# EAGLE design meetring ic (EAGLE 9.6.2)
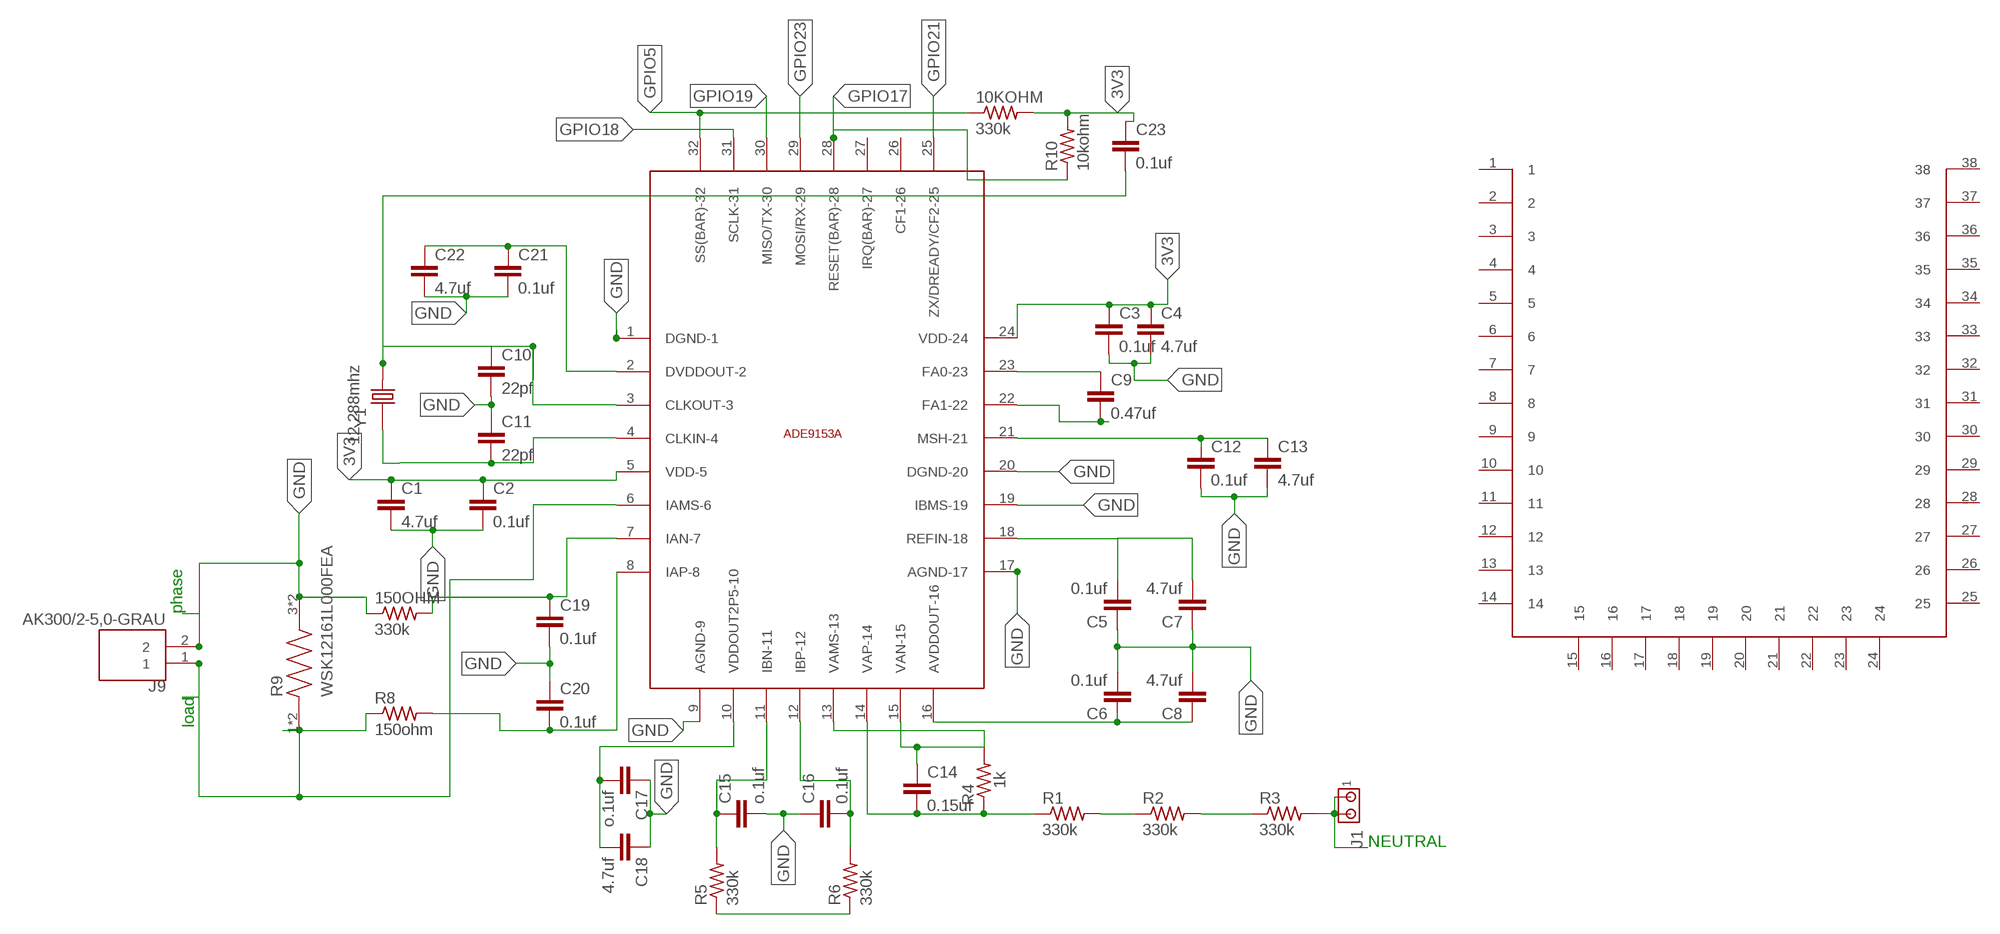
[diagram p0: schematic, sheet 1]

## Parts
10KOHM  330k  R-US_0204/7  [0204/7]
150OHM  330k  R-US_0204/7  [0204/7]
C1  4.7uf  C2.5/2  [C2.5-2]
C2  0.1uf  C2.5/2  [C2.5-2]
C3  0.1uf  C2.5/2  [C2.5-2]
C4  4.7uf  C2.5/2  [C2.5-2]
C5  0.1uf  C2.5/2  [C2.5-2]
C6  0.1uf  C2.5/2  [C2.5-2]
C7  4.7uf  C2.5/2  [C2.5-2]
C8  4.7uf  C2.5/2  [C2.5-2]
C9  0.47uf  C2.5/2  [C2.5-2]
C10  22pf  C2.5/2  [C2.5-2]
C11  22pf  C2.5/2  [C2.5-2]
C12  0.1uf  C2.5/2  [C2.5-2]
C13  4.7uf  C2.5/2  [C2.5-2]
C14  0.15uf  C2.5/2  [C2.5-2]
C15  o.1uf  C2.5/2  [C2.5-2]
C16  0.1uf  C2.5/2  [C2.5-2]
C17  o.1uf  C2.5/2  [C2.5-2]
C18  4.7uf  C2.5/2  [C2.5-2]
C19  0.1uf  C2.5/2  [C2.5-2]
C20  0.1uf  C2.5/2  [C2.5-2]
C21  0.1uf  C2.5/2  [C2.5-2]
C22  4.7uf  C2.5/2  [C2.5-2]
C23  0.1uf  C2.5/2  [C2.5-2]
J1  MTA02-156  [1X2MTA]
J9  AK300/2-5,0-GRAU  [PTR_AK300/2-5,0-GRAU]
R1  330k  R-US_0204/7  [0204/7]
R2  330k  R-US_0204/7  [0204/7]
R3  330k  R-US_0204/7  [0204/7]
R4  1k  R-US_0204/7  [0204/7]
R5  330k  R-US_0204/7  [0204/7]
R6  330k  R-US_0204/7  [0204/7]
R8  150ohm  R-US_0204/7  [0204/7]
R9  WSK12161L000FEA  [RES_WSK12161L000FEA]
R10  10kohm  R-US_0204/7  [0204/7]
U$1  ADE9153A_BASEADE9153A_BASE  [ADE9153A_BASE]
U$2  LIB1OPTION_HOLE  [1X14MTA]
Y1  12.288mhz  ECS-240.0001-18-1X  [XTAL_ECS-200-20-1X]

## Nets
3V3: 10KOHM.2 C1.1 C2.1 C3.1 C4.1 C23.1 R10.2 U$1.5(VDD-5) U$1.24(VDD-24)
GND: 150OHM.1 C1.2 C2.2 C3.2 C4.2 C5.1 C6.2 C7.1 C8.2 C10.2 C11.1 C12.2 C13.2 C15.2 C16.1 C17.1 C18.1 C19.2 C20.1 C21.2 C22.2 J9.2 R9.3 R9.4 U$1.1(DGND-1) U$1.9(AGND-9) U$1.17(AGND-17) U$1.19(IBMS-19) U$1.20(DGND-20)
GPIO5: 10KOHM.1 U$1.32(SS(BAR)-32)
GPIO17: R10.1 U$1.28(RESET(BAR)-28)
GPIO18: U$1.31(SCLK-31)
GPIO19: U$1.30(MISO/TX-30)
GPIO21: U$1.25(ZX/DREADY/CF2-25)
GPIO23: U$1.29(MOSI/RX-29)
N$3: C6.1 C8.1 U$1.16(AVDDOUT-16)
N$4: C5.2 C7.2 U$1.18(REFIN-18)
N$5: C9.1 U$1.23(FA0-23)
N$6: C9.2 U$1.22(FA1-22)
N$7: C11.2 U$1.4(CLKIN-4) Y1.1
N$8: C10.1 C23.2 U$1.3(CLKOUT-3) Y1.2
N$9: C12.1 C13.1 U$1.21(MSH-21)
N$11: C14.2 R1.1 R4.1 U$1.14(VAP-14)
N$12: R1.2 R2.1
N$13: R2.2 R3.1
N$14: C14.1 R4.2 U$1.13(VAMS-13) U$1.15(VAN-15)
N$15: C16.2 R6.2 U$1.12(IBP-12)
N$16: C15.1 R5.2 U$1.11(IBN-11)
N$18: C17.2 C18.2 U$1.10(VDDOUT2P5-10)
N$19: R5.1 R6.1
N$20: 150OHM.2 C19.1 U$1.7(IAN-7)
N$21: C20.2 R8.2 U$1.8(IAP-8)
N$22: C21.1 C22.1 U$1.2(DVDDOUT-2)
N$24: J9.1 R8.1 R9.1 R9.2 U$1.6(IAMS-6)
N$27: J1.1 J1.2 R3.2
Unconnected: U$1.26(CF1-26) U$1.27(IRQ(BAR)-27) U$2.1 U$2.2 U$2.3 U$2.4 U$2.5 U$2.6 U$2.7 U$2.8 U$2.9 U$2.10 U$2.11 U$2.12 U$2.13 U$2.14 U$2.15 U$2.16 U$2.17 U$2.18 U$2.19 U$2.20 U$2.21 U$2.22 U$2.23 U$2.24 U$2.25 U$2.26 U$2.27 U$2.28 U$2.29 U$2.30 U$2.31 U$2.32 U$2.33 U$2.34 U$2.35 U$2.36 U$2.37 U$2.38

## Notes on the sheet
- phase
- load
- NEUTRAL

## Library data of the parts
10KOHM 150OHM R1-R6 R8 R10 = rcl:R-US_: RESISTOR, American symbol; SPICEPREFIX: R
C1-C23 = capacitor-wima:C: CAPACITOR naming: grid - package width
J1 = con-amp:MTA02-156: AMP connector
J9 = AK300_2-5_0-GRAU:AK300/2-5,0-GRAU: Terminal block; 5mm; angled 45°; ways: 2 Check availability <https://pricing.snapeda.com/parts/AK300/2-5%2C0-GRAU/PTR%20Messtechnik/view-part?ref=eda>; AVAILABILITY: Not in stock; DESCRIPTION: Terminal block; 5mm; angled 45°; ways: 2; MF: PTR Messtechnik; MP: AK300/2-5,0-GRAU; PACKAGE: None; PRICE: None
R9 = WSK12161L000FEA:WSK12161L000FEA: 1 mOhms ±1% 3W Chip Resistor Wide 1612 (3831 Metric), 1216 Current Sense, Moisture Resistant, Pulse Withstanding Metal Element Check availability <https://pricing.snapeda.com/parts/WSK12161L000FEA/Vishay%20Intertechnology/view-part?ref=eda>; AVAILABILITY: In Stock; DESCRIPTION: 1 mOhms ±1% 3W Chip Resistor Wide 1612 (3831 Metric), 1216 Anti-Sulfur, Automotive AEC-Q200, Current Sense, Pulse Withstanding Metal Element; MF: Vishay Intertechnology; MP: WSK12161L000FEA; PACKAGE: None; PRICE: None; PURCHASE-URL: https://pricing.snapeda.com/search/part/WSK12161L000FEA/?ref=eda
U$1 = ADE9153A_base:ADE9153A_BASE
U$2 = esp32_base_footprint:LIB1
Y1 = ECS-240.0001-18-1X:ECS-240.0001-18-1X: Crystal HC49/U T/H Check availability <https://pricing.snapeda.com/parts/ECS-240.0001-18-1X/ECS%20International/view-part?ref=eda>; AVAILABILITY: In Stock; DESCRIPTION: Crystals / Oscillators / Resonators 24.00014MHz 18pF; MF: ECS International; MP: ECS-240.0001-18-1X; PACKAGE: HC49/U ECS International; PRICE: None

## Board
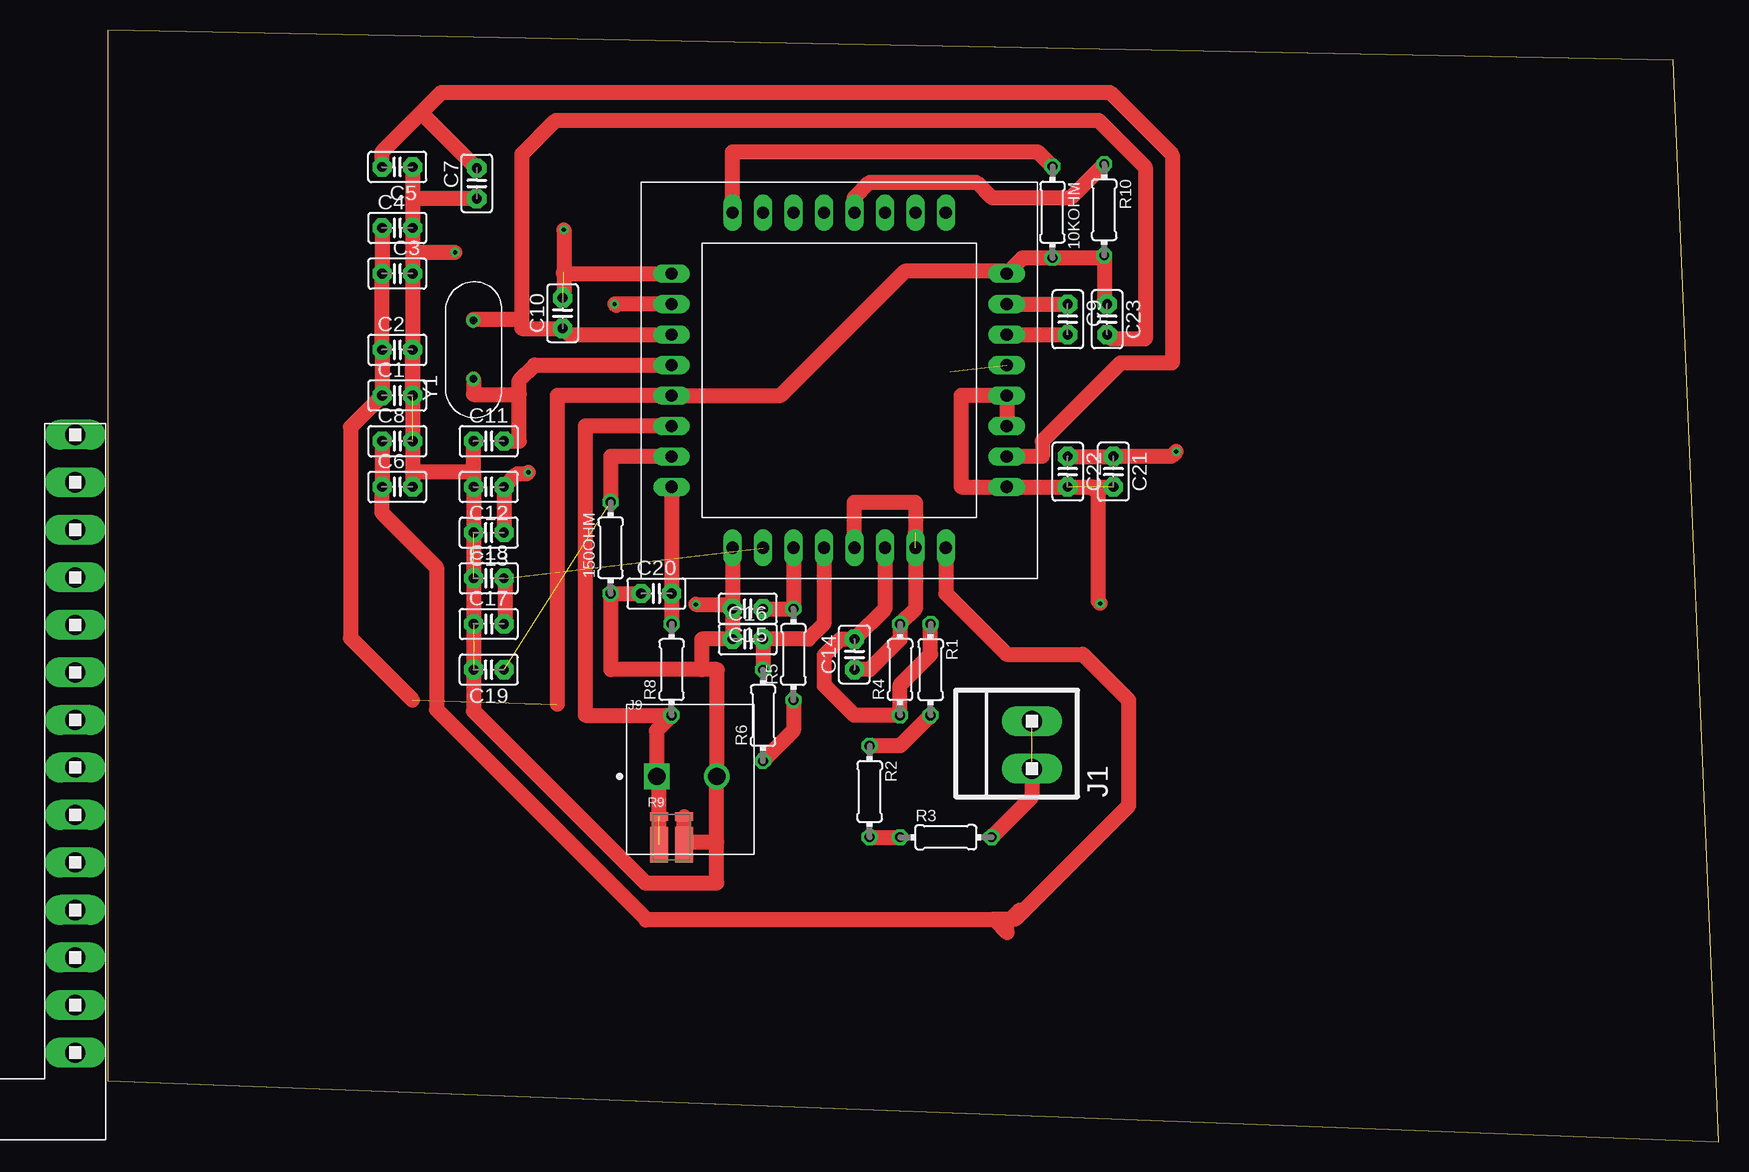
[diagram p1: board, top side]
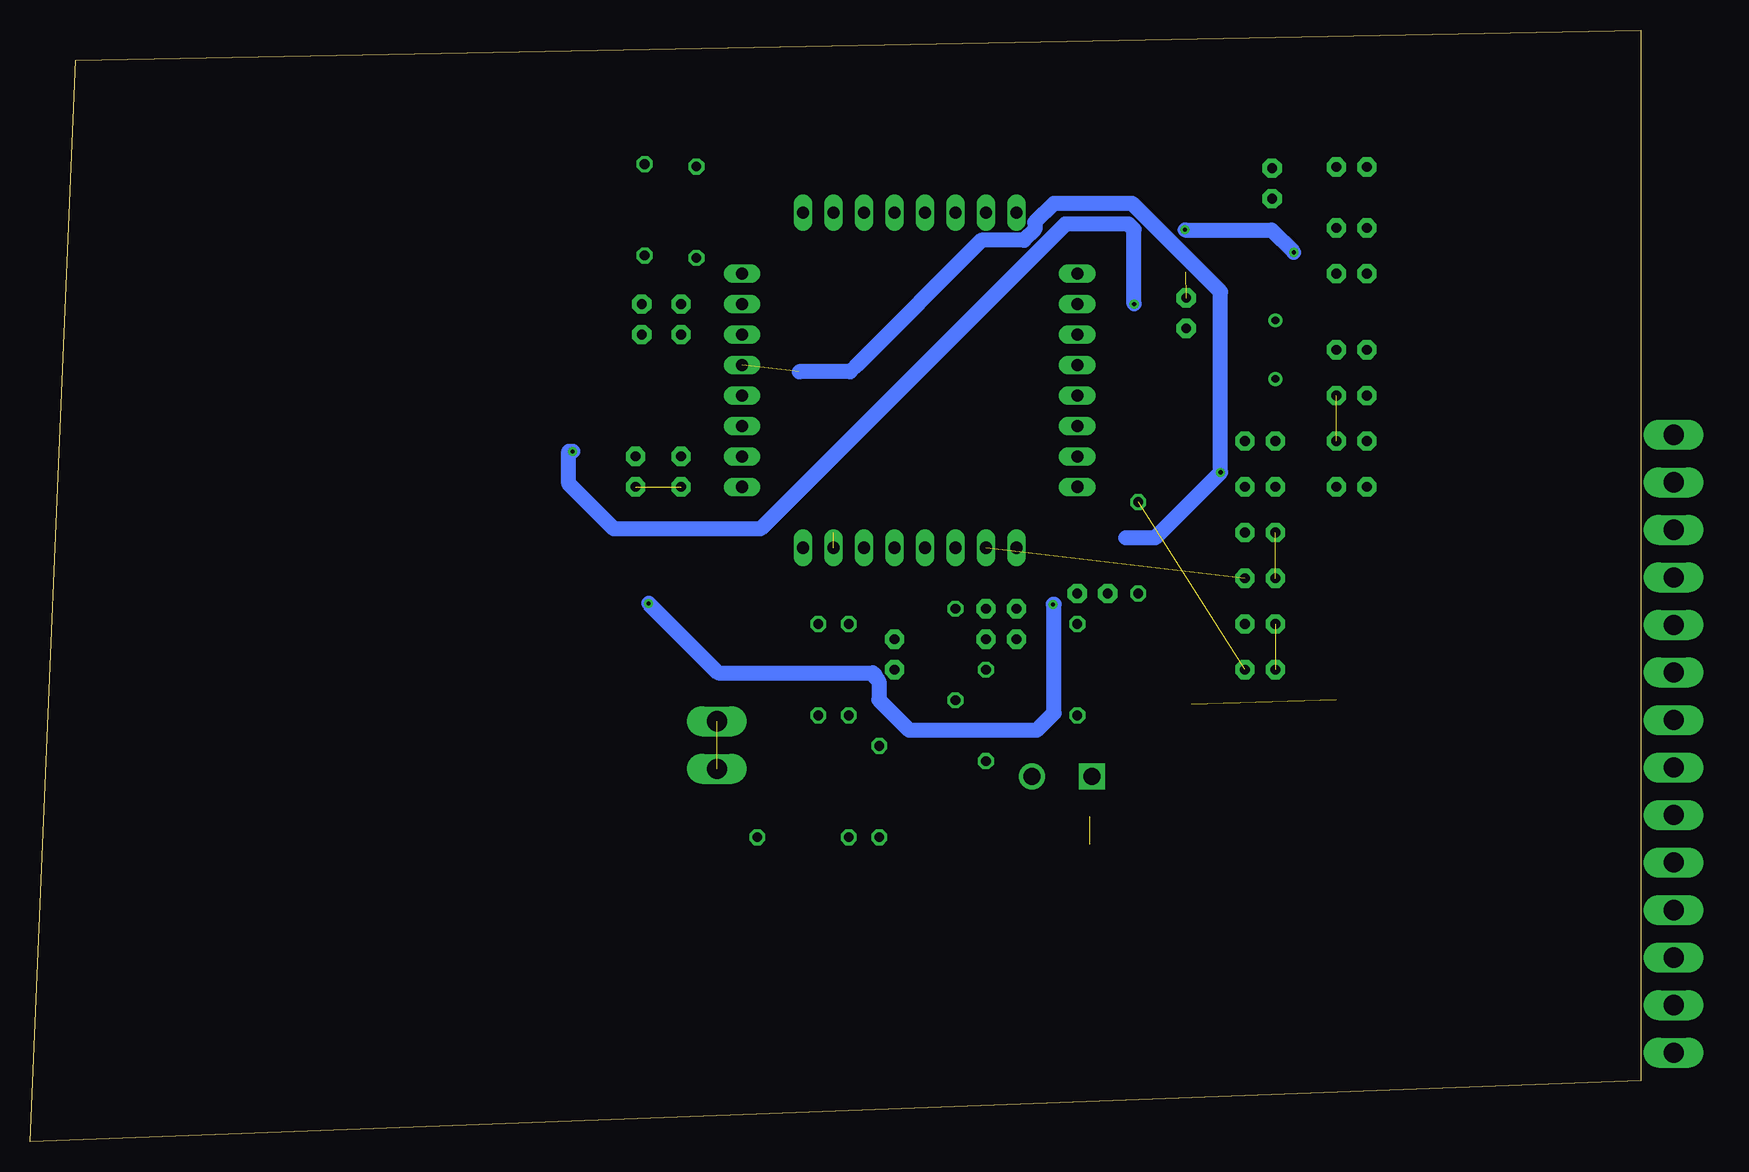
[diagram p2: board, bottom side, seen from below]

Size 134.29 x 92.7 mm. Coordinates in mm from the lower left corner, seen from the top.
Outline: 0,5.08 134.29,0 130.48,90.16 0,92.7 0,5.08
Copper layers (1*16): Top 0.035mm / dielectric 1.5mm / Bottom 0.035mm
Design rules "default": minimum track width 6mil, minimum drill 0.35mm, track to track 6mil, track to pad 6mil, pad to pad 6mil, via to via 6mil, smd to smd 6mil, copper to edge 40mil, drill to drill 6mil, minimum pad ring 10mil, minimum via ring 8mil, stop-mask expansion 4mil, vias tented up to drill 0mil, thermal gap 10mil

### Footprints (pad centres in the part's own frame; a part is rotated, then mirrored left to right if it is on the bottom)
0204/7 = drill 0.813 octagon: 1 -3.81,0; 2 3.81,0
C2.5-2 = drill 0.813 pad 1.6 octagon: 1 -1.27,0; 2 1.27,0
1X2MTA = drill 1.676 long: 1 1.981,0; 2 -1.981,0
PTR_AK300/2-5,0-GRAU = drill 1.43 square: 1 -2.5,0 | drill 1.43: 2 2.5,0
RES_WSK12161L000FEA = smd 1.495 x 0.7: 1 -1.052,1.725; 4 1.052,1.725 | smd 1.495 x 2.95: 2 -1.052,-0.6; 3 1.052,-0.6
ADE9153A_BASE = drill 1.016 long: 1 -43.18,12.7; 2 -43.18,10.16; 3 -43.18,7.62; 4 -43.18,5.08; 5 -43.18,2.54; 6 -43.18,0; 7 -43.18,-2.54; 8 -43.18,-5.08; 9 -38.1,-10.16; 10 -35.56,-10.16; 11 -33.02,-10.16; 12 -30.48,-10.16; 13 -27.94,-10.16; 14 -25.4,-10.16; 15 -22.86,-10.16; 16 -20.32,-10.16; 17 -15.24,-5.08; 18 -15.24,-2.54; 19 -15.24,0; 20 -15.24,2.54; 21 -15.24,5.08; 22 -15.24,7.62; 23 -15.24,10.16; 24 -15.24,12.7; 25 -20.32,17.78; 26 -22.86,17.78; 27 -25.4,17.78; 28 -27.94,17.78; 29 -30.48,17.78; 30 -33.02,17.78; 31 -35.56,17.78; 32 -38.1,17.78
1X14MTA = drill 1.676 long: 1 -27.94,23.216; 2 -27.94,19.253; 3 -27.94,15.291; 4 -27.94,11.328; 5 -27.94,7.366; 6 -27.94,3.404; 7 -27.94,-0.559; 8 -27.94,-4.521; 9 -27.94,-8.484; 10 -27.94,-12.446; 11 -27.94,-16.408; 12 -27.94,-20.371; 13 -27.94,-24.333; 14 -27.94,-28.296; 15 -20.676,-33.02; 16 -16.713,-33.02; 17 -12.751,-33.02; 18 -8.788,-33.02; 19 -4.826,-33.02; 20 -0.864,-33.02; 21 3.099,-33.02; 22 7.061,-33.02; 23 11.024,-33.02; 24 14.986,-33.02; 25 22.86,-28.296; 26 22.86,-24.333; 27 22.86,-20.371; 28 22.86,-16.408; 29 22.86,-12.446; 30 22.86,-8.484; 31 22.86,-4.521; 32 22.86,-0.559; 33 22.86,3.404; 34 22.86,7.366; 35 22.86,11.328; 36 22.86,15.291; 37 22.86,19.253; 38 22.86,23.216
XTAL_ECS-200-20-1X = drill 0.63 pad 1.03: 1 -2.44,0; 2 2.44,0

### Placement (x,y rotation side)
10KOHM  78.74,77.51 270 top
150OHM  41.91,49.53 90 top
C1  24.13,62.23 0 top
C2  24.13,66.04 0 top
C3  24.13,72.39 0 top
C4  24.13,76.2 0 top
C5  24.13,81.28 180 top
C6  24.13,54.61 0 top
C7  30.76,79.91 90 top
C8  24.13,58.42 0 top
C9  80.01,68.58 270 top
C10  37.92,69.09 90 top
C11  31.75,58.42 0 top
C12  31.75,54.61 180 top
C13  31.75,50.8 180 top
C14  62.23,40.64 90 top
C15  53.34,44.45 180 top
C16  53.34,41.91 0 top
C17  31.75,43.18 0 top
C18  31.75,46.99 0 top
C19  31.75,39.37 180 top
C20  45.72,45.72 0 top
C21  83.82,55.88 270 top
C22  80.01,55.88 270 top
C23  83.3,68.58 270 top
J1  77.03,33.09 90 top
J9  48.26,30.48 0 top
R1  68.58,39.37 270 top
R2  63.5,29.21 270 top
R3  69.85,25.4 0 top
R4  66.04,39.37 90 top
R5  57.15,40.64 90 top
R6  54.61,35.56 90 top
R8  46.99,39.37 90 top
R9  46.99,25.4 0 top
R10  83.05,77.71 270 top
U$1  90.17,59.69 0 top
U$2  -25.58,35.74 0 top
Y1  30.48,66.04 90 top

### Tracks (layer width: path | path; a pad name or v marks a point on that pad's centre or on a via)
3V3  (1 unrouted)
  Top 1.27: C23.1 83.05,70.09 R10.2 82.85,73.7 10KOHM.2 76.24,73.7 U$1.24 74.74,72.58 66.43,72.58 56.09,62.23 U$1.5 37.46,62.23 37.46,36.48 | C4.1 C3.1 C2.1 C1.1 20.23,59.6 20.23,42 25.4,36.83
GND  (via drill 0.35)  (5 unrouted)
  Top 1.27: 25.4,74.16 C3.2 C2.2 | 25.4,78.64 C4.2 25.4,74.16 | 30.48,55.88 C12.2 | C12.2 C13.2 C19.2 | U$1.9 C15.2 | C15.2 C16.1 49.53,41.91 49.53,39.37 | 82.05,54.61 U$1.17 71.12,54.61 71.12,62.23 U$1.20 U$1.19 | 82.05,54.61 C21.2 | C1.2 C2.2 | C10.2 37.92,70.7 38.02,70.8 v38.02,76.05 | U$1.1 37.96,72.39 37.96,72.5 | C5.1 25.4,78.64 | C2.2 25.4,55.88 | 25.4,55.88 C6.2 | 25.4,55.88 30.48,55.88 | 30.48,55.88 C11.1 | C7.1 25.4,78.64 | C12.2 C19.2 | C19.2 30.48,35.93 44.81,21.59 50.76,21.59 50.76,25 | 50.76,25 J9.2 50.8,30.52 50.8,39.37 49.53,39.37 | C20.1 150OHM.1 41.91,39.37 49.53,39.37 | R9.4 R9.3 48.24,25 50.76,25 | 25.4,74.16 v28.94,74.16 | 82.05,54.61 82.55,54.11 82.55,45.07 v82.72,44.9 | v49.02,44.81 51.71,44.81 C15.2
  Bottom 1.27: v28.94,74.16 30.8,76.02 38.02,76.02 v38.02,76.05 | v82.72,44.9 76.94,39.11 64.02,39.11 63.82,38.91 63.82,38.71 63.52,38.42 63.52,36.85 61.01,34.34 50.36,34.34 48.93,35.76 48.93,44.81 v49.02,44.81
GPIO5
  Top 1.27: U$1.32 52.07,82.55 77.51,82.55 10KOHM.1
GPIO17
  Top 1.27: U$1.28 62.23,78.74 63.5,80.01 72.39,80.01 73.66,78.74 80.27,78.74 R10.1
N$3
  Top 1.27: 73.9,18.51 74.96,17.44 74.96,18.27 76.01,19.31 | 73.9,18.51 73.85,18.56 75.62,18.56 85.09,28.03 85.09,36.83 81.28,40.64 74.93,40.64 69.85,45.72 U$1.16 | 73.9,18.51 44.85,18.51 44.85,18.58 27.39,36.04 27.39,47.9 22.86,52.43 C6.1 C8.1
N$4
  Top 1.27: U$1.18 77.89,57.15 77.89,58.42 84.41,64.94 88.73,64.94 88.73,82.29 83.52,87.5 27.81,87.5 25.88,85.57 | 25.88,85.57 22.86,82.55 C5.2 | 25.88,85.57 26.36,85.57 C7.2
N$5
  Top 1.27: U$1.23 C9.1
N$6
  Top 1.27: U$1.22 C9.2
N$7
  Top 1.27: Y1.1 30.48,62.32 34.29,62.32 | 34.29,62.32 34.29,63.5 35.56,64.77 U$1.4 | C11.2 34.29,58.42 34.29,62.32
N$8
  Top 1.27: 30.48,68.58 Y1.2 30.58,68.58 34.53,68.58 | U$1.3 38.43,67.31 C10.1 34.53,67.82 34.53,68.58 | 34.53,68.58 34.53,82.35 37.34,85.17 82.59,85.17 86.47,81.28 86.47,66.95 83.66,66.95 C23.2
N$9  (via drill 0.35)  (1 unrouted)
  Top 1.27: C13.1 C12.1 34.12,55.71 34.58,55.71 34.93,55.71 v35.05,55.82
  Bottom 1.27: 42.96,50.35 40.52,50.35 v35.05,55.82 35.05,70.87 41.61,77.43 | 41.61,77.43 | 41.61,77.43 42.41,78.23 48.95,78.23 50.52,76.66 50.52,76.07 51.43,75.16 54.98,75.16 65.41,64.73 65.93,64.2 70.18,64.2
N$11
  Top 1.27: R1.1 68.58,40.64 66.04,38.1 R4.1 62.23,35.56 59.74,38.05 59.74,40.59 61.05,41.91 C14.2 64.77,44.45 U$1.14
N$12
  Top 1.27: R1.2 66.04,33.02 R2.1
N$13
  Top 1.27: R2.2 R3.1
N$14  (1 unrouted)
  Top 1.27: U$1.13 62.23,53.34 67.31,53.34 67.31,50.8 | U$1.15 67.31,44.45 R4.2 66.04,41.91 63.5,39.37 C14.1
N$15
  Top 1.27: U$1.12 59.69,43.18 58.42,41.91 C16.2 R6.2
N$16
  Top 1.27: U$1.11 R5.2 C15.1
N$18  (1 unrouted)
  Top 1.27: C18.2 33.12,46.89 33.12,43.28 C17.2
N$19
  Top 1.27: R5.1 57.15,34.29 R6.1
N$20  (1 unrouted)
  Top 1.27: U$1.7 41.91,57.15 150OHM.2
N$21
  Top 1.27: U$1.8 C20.2 R8.2
N$22  (via drill 0.35)
  Top 1.27: C22.1 C21.1 88.65,57.15 v89.06,57.56 | U$1.2 42.5,69.85 42.38,69.72 v42.25,69.85 | v42.25,69.85
  Bottom 1.27: v42.25,69.85 42.25,76.06 42.71,76.52 47.99,76.52 73.41,51.1 85.62,51.1 89.39,54.87 89.39,57.56 v89.06,57.56
N$24  (1 unrouted)
  Top 1.27: U$1.6 39.79,59.69 39.79,35.56 R8.1 45.72,34.29 45.72,30.52 J9.1 45.94,30.3 R9.2
N$27  (1 unrouted)
  Top 1.27: J1.2 77.03,28.77 R3.2